# EasyEDA Pro project 激光主轴转接板V1.0.eprj

# Schematic 原理图
Board Name: 电控箱转接; Create Date: 2024-04-22; Page Name: 主控MCU; Project Name: 转接板03; Schematic Name: 原理图; Update Date: 2025-07-30; Company: 嘉立创EDA; Page Size: A3; Version: V1.0
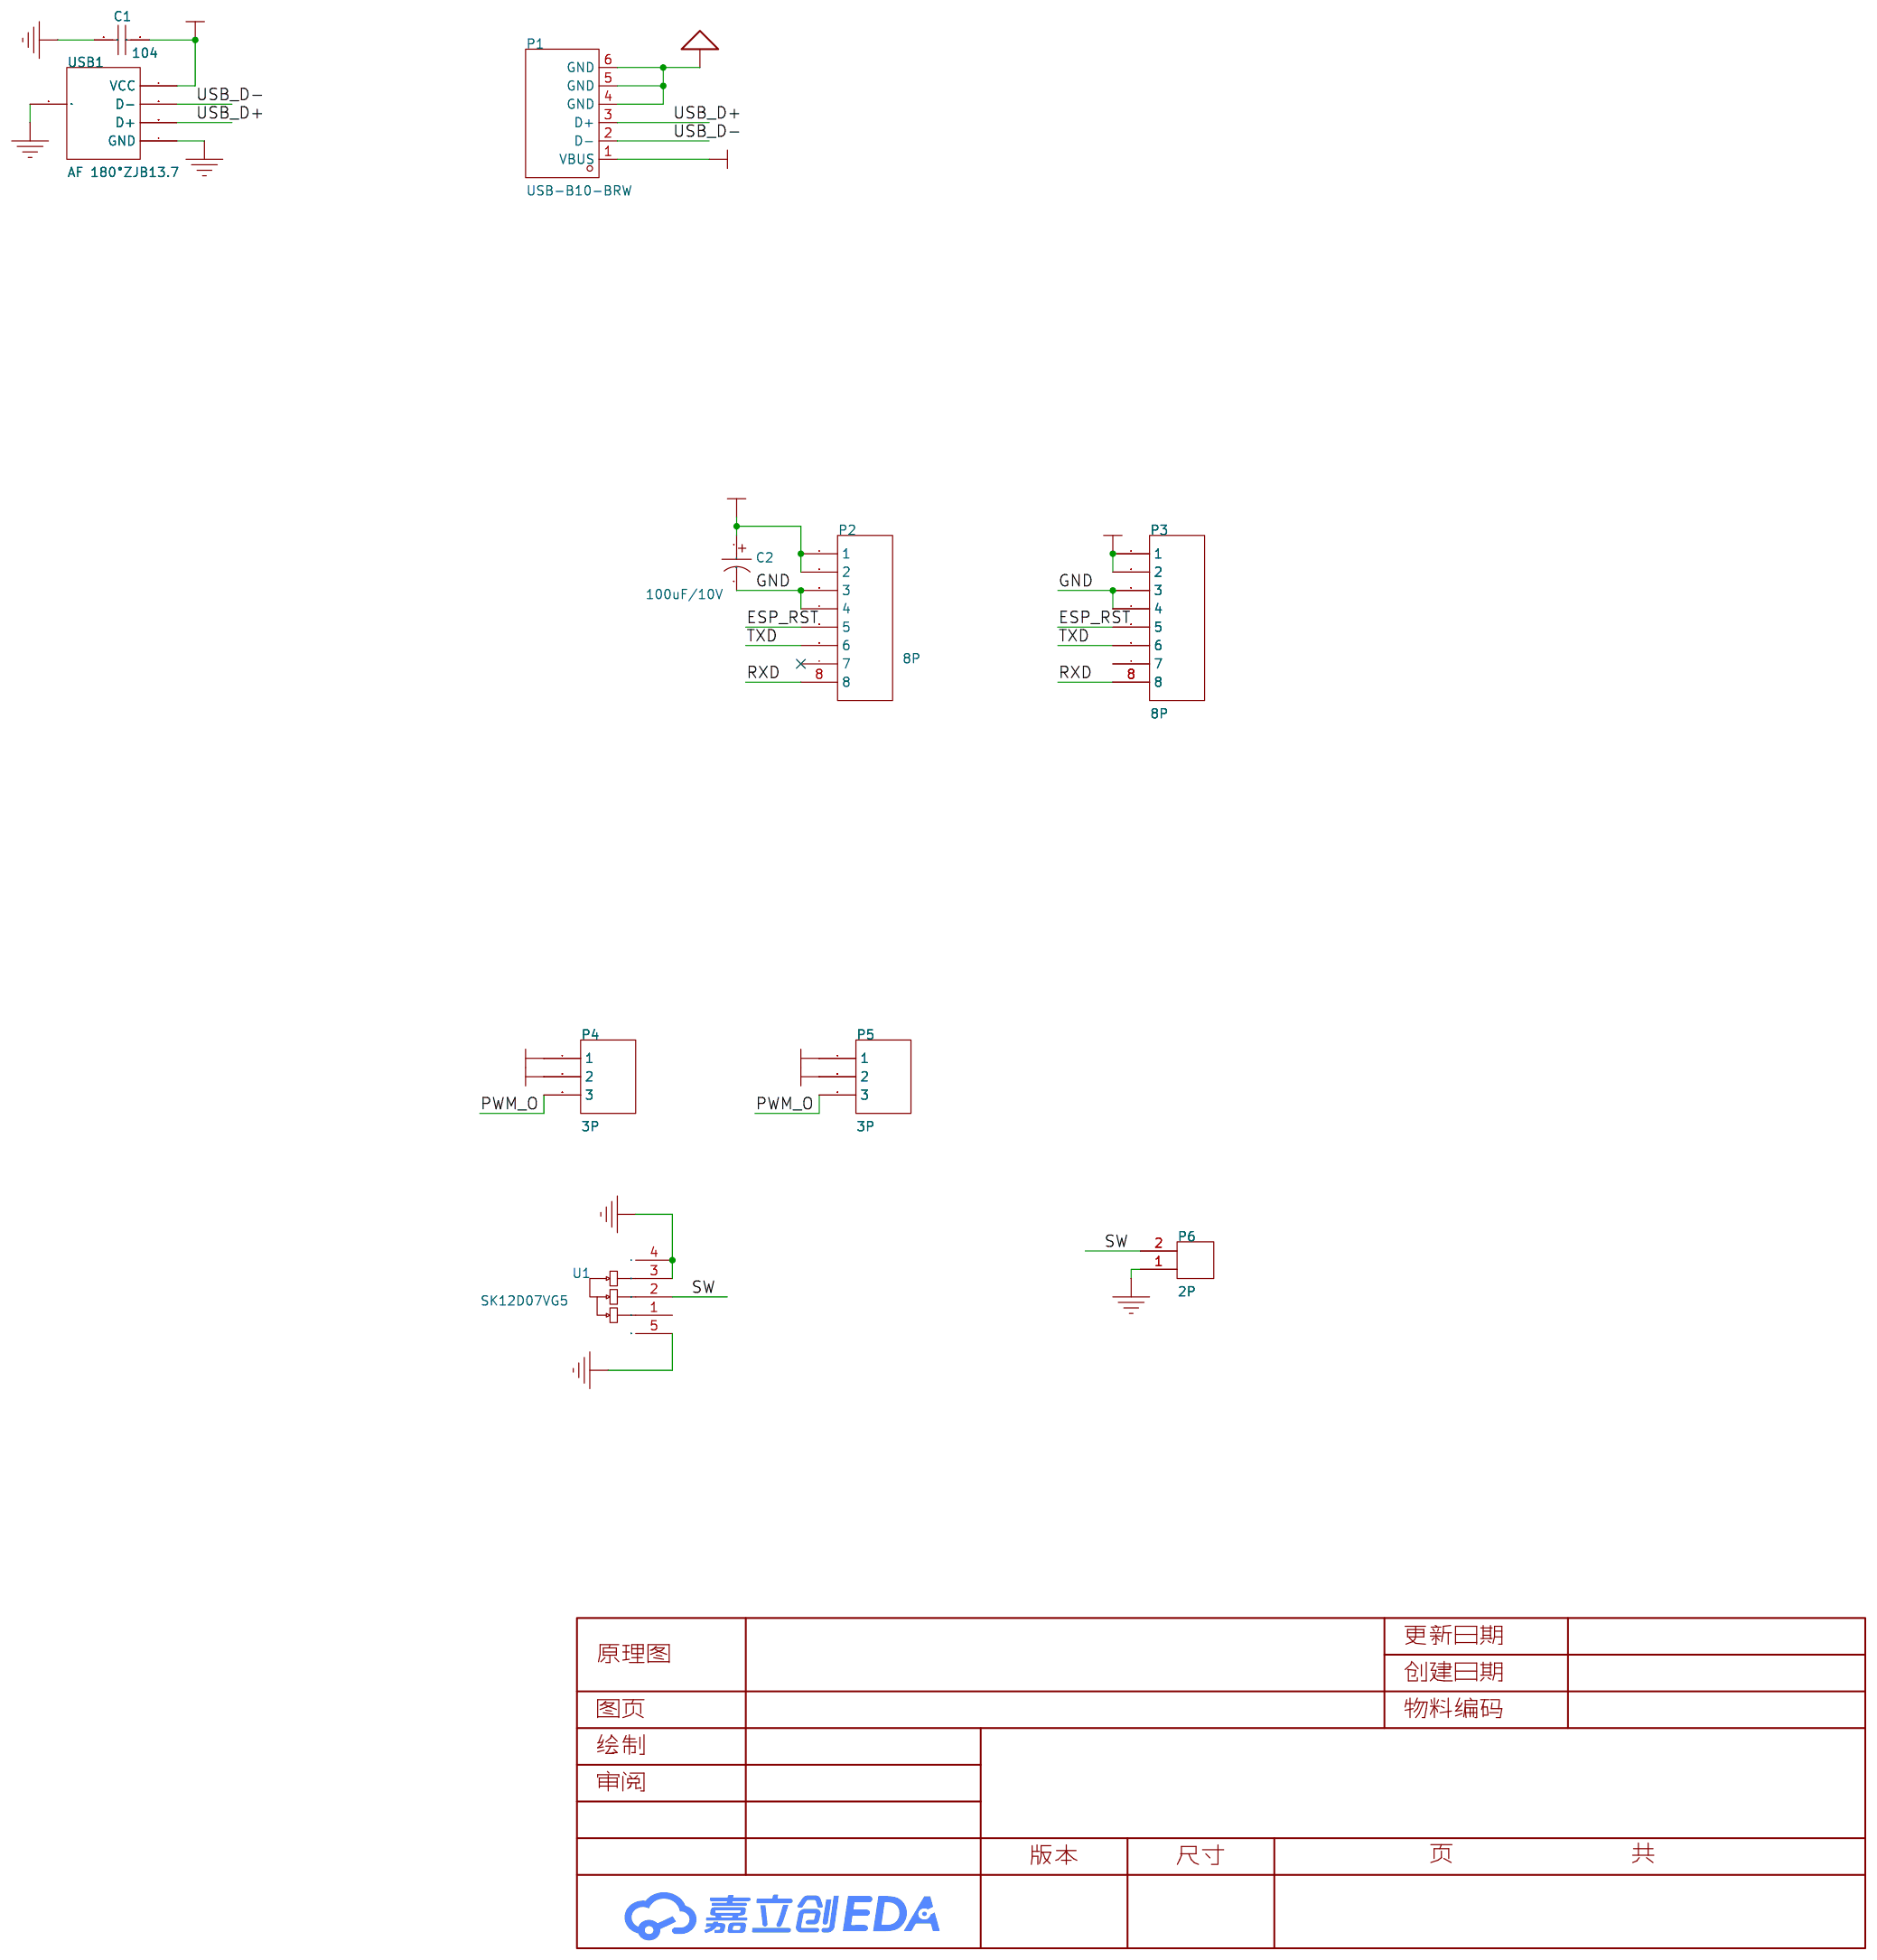
[diagram p0: schematic sheet]

## Parts
C1  104  [0603C]
C2  100uF/10V  [CAP-SMD_BD5.0-L5.3-W5.3-RD]
P1  USB-B10-BRW  [USB-B-TH_USB-B10-BRW]
P2  8P  [IDC8]
P3  8P  [IDC8弯脚]
P4  3P  [HDR1X3_CON]
P5  3P  [HDR1X3_P]
P6  2P  [HDR1X2_CON]
U1  SK12D07VG5  [SW-TH_SHOU_SK12D07VG5]
USB1  AF 180°ZJB13.7  [USB-A-TH_AF-ZJB13.7]

## Library data of the parts
C1 = 104: Capacitor (Semiconductor SIM Model); Published: 8-Jun-2000; LatestRevisionDate: 17-Jul-2002; LatestRevisionNote: Re-released for DXP Platform.; PackageReference: C1206; Publisher: Altium Limited; Origin Footprint 2: C1206; Origin Footprint 3: 0402; Origin Footprint 4: 1310[0504]; Origin Footprint 5: 1608[0603]; Origin Footprint 6: C1210; Origin Footprint 7: C0805; Origin Footprint 8: C1206; Origin Footprint 9: 0805; Origin Footprint 10: 0805L; Design Item ID: Cap Semi; Library Name: Miscellaneous Devices
C2 = CS1A101M-CRD54: 容值:100uF;精度:±20%;额定电压:10V;电容体直径:5mm;电容体长度:5.4mm;纹波电流:-;等效串联电阻:-;工作寿命:1000hrs@105℃;工作温度:-40℃~+105℃;; LCSC Part Name: 100uF ±20% 10V; Supplier Part: C96182; Manufacturer: ST(先科); Supplier Footprint: SMD,5x5.4mm; JLCPCB Part Class: Extended Part; Datasheet: https://atta.szlcsc.com/upload/public/pdf/source/20170304/1488621207726.pdf; Supplier: LCSC; Tolerance: ±20%; Rated Voltage: 10V; φD: 5mm; L: 5.4mm; Lifetime @ Temp: 1000hrs@105℃; Operating Temperature: -40℃~+105℃
P1 = USB-B10-BRW: 连接器类型:Type-B;标准:USB 2.0;公母:母;端口数量:1;触点数量:4P;安装方式:弯插;额定电流 - 电源:1.5A;工作温度范围:-20℃~+70℃;焊接温度(最大值):260℃;; LCSC Part Name: Type-B母弯插; Supplier Part: C720549; Manufacturer: XUNPU(讯普); Supplier Footprint: 插件; JLCPCB Part Class: 扩展库; Datasheet: https://atta.szlcsc.com/upload/public/pdf/source/20200812/C720549_53E9294752E2933874870440E626C579.pdf; Supplier: LCSC; Connector Type: Type-B; Standard: USB2.0; Gender: 母; Number of Ports: 1; Number of Contacts: 4P; Mounting Style: 弯插; Current Rating - Power (Max): 1.5A; Operating Temperature Range: -20℃~+70℃; Soldering Temperature(Max): 260℃
P2 P3 = 8P: Library Name: SCH封装库
P4 P5 = 3P: Library Name: SCH封装库
P6 = 2P: Library Name: SCH--װ--
U1 = SK12D07VG5_C3020419: Supplier Part: C3020419; Manufacturer: SHOU HAN(首韩); Supplier Footprint: 插件; JLCPCB Part Class: 扩展库; Datasheet: https://atta.szlcsc.com/upload/public/pdf/source/20190925/C431548_D6571AEBDE139FDB1E6F8A4B1513A630.pdf; Supplier: LCSC; Circuit: 单刀双掷; Termination Style: PC引脚; Length: 8.7mm; Width: 4.4mm; Switch Height: 4.7mm; Current Rating: 500mA; Voltage Rating: 50V; Life: 5千次; Operating Temperature: -10℃~+50℃
USB1 = AF 180°ZJB13.7: LCSC Part Name: Type-A 母 直插; Supplier Part: C456015; Manufacturer: SHOU HAN(首韩); Supplier Footprint: 插件; JLCPCB Part Class: 扩展库; Datasheet: https://atta.szlcsc.com/upload/public/pdf/source/20241125/3F1287FBF237B0DC4F79F9BB9BA7EB30.pdf; Supplier: LCSC; Connector Type: Type-A; Standard: USB 2.0; Gender: 母; Mounting Style: 直插; Number of Contacts: 4P; Number of Ports: 1; Current Rating - Power (Max): 1.5A; Rated Voltage (Max): 30V; Connect-Disconnect Life: 5千次; Length: 13.7mm; Core Colour: 白色; Operating Temperature Range: -25℃~+85℃

## Nets
5V_VCC: C2.1 P2.1 P2.2 P3.1 P3.2
24V: P4.1 P5.1
GND: C1.2 C2.2 P1.4(GND) P1.5(GND) P1.6(GND) P2.3 P2.4 P3.3 P3.4 P4.2 P5.2 P6.1 U1.3 U1.4 U1.5 USB1.4(GND) USB1.5(SHLD)
ESP_RST: P2.5 P3.5
PWM_O: P4.3 P5.3
RXD: P2.8 P3.8
SW: P6.2 U1.2
TXD: P2.6 P3.6
USB_D+: P1.3(D+) USB1.3(D+)
USB_D-: P1.2(D-) USB1.2(D-)
VUSB: C1.1 P1.1(VBUS) USB1.1(VCC)

Not connected (* = marked no-connect by the designer): P2 7*; P3 7; U1 1

# Board PCB
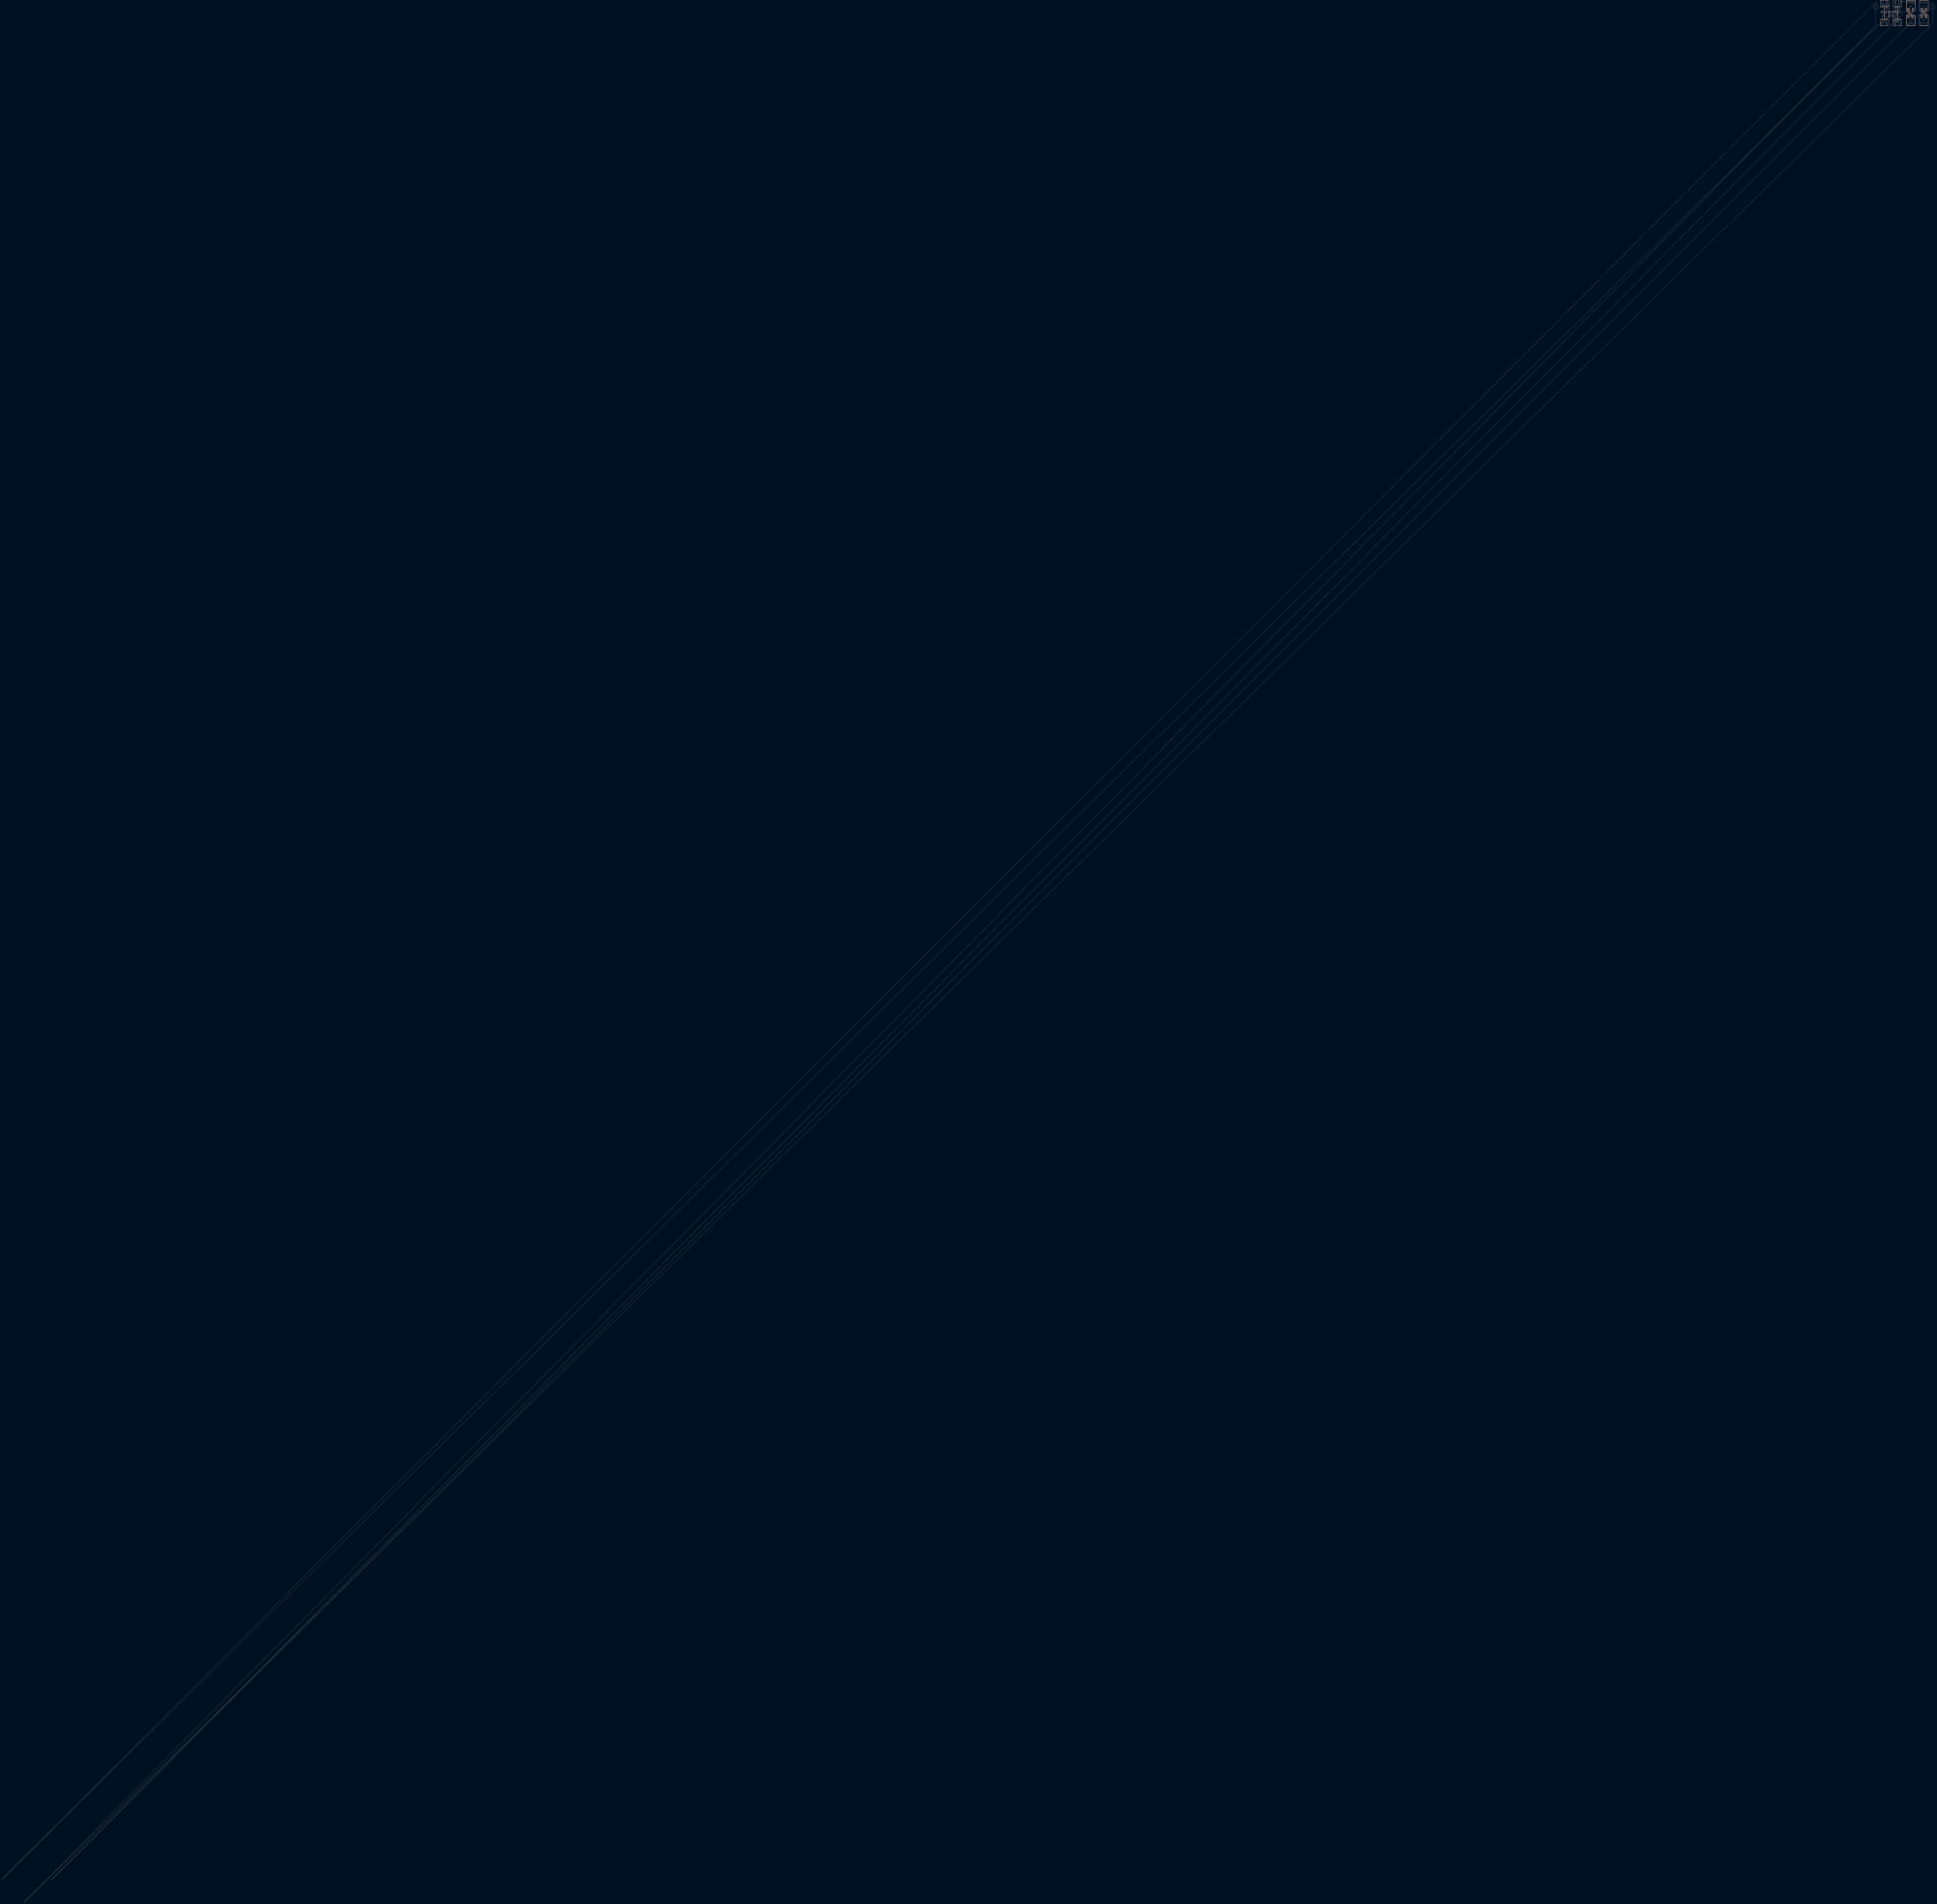
[diagram p1: board, top side]
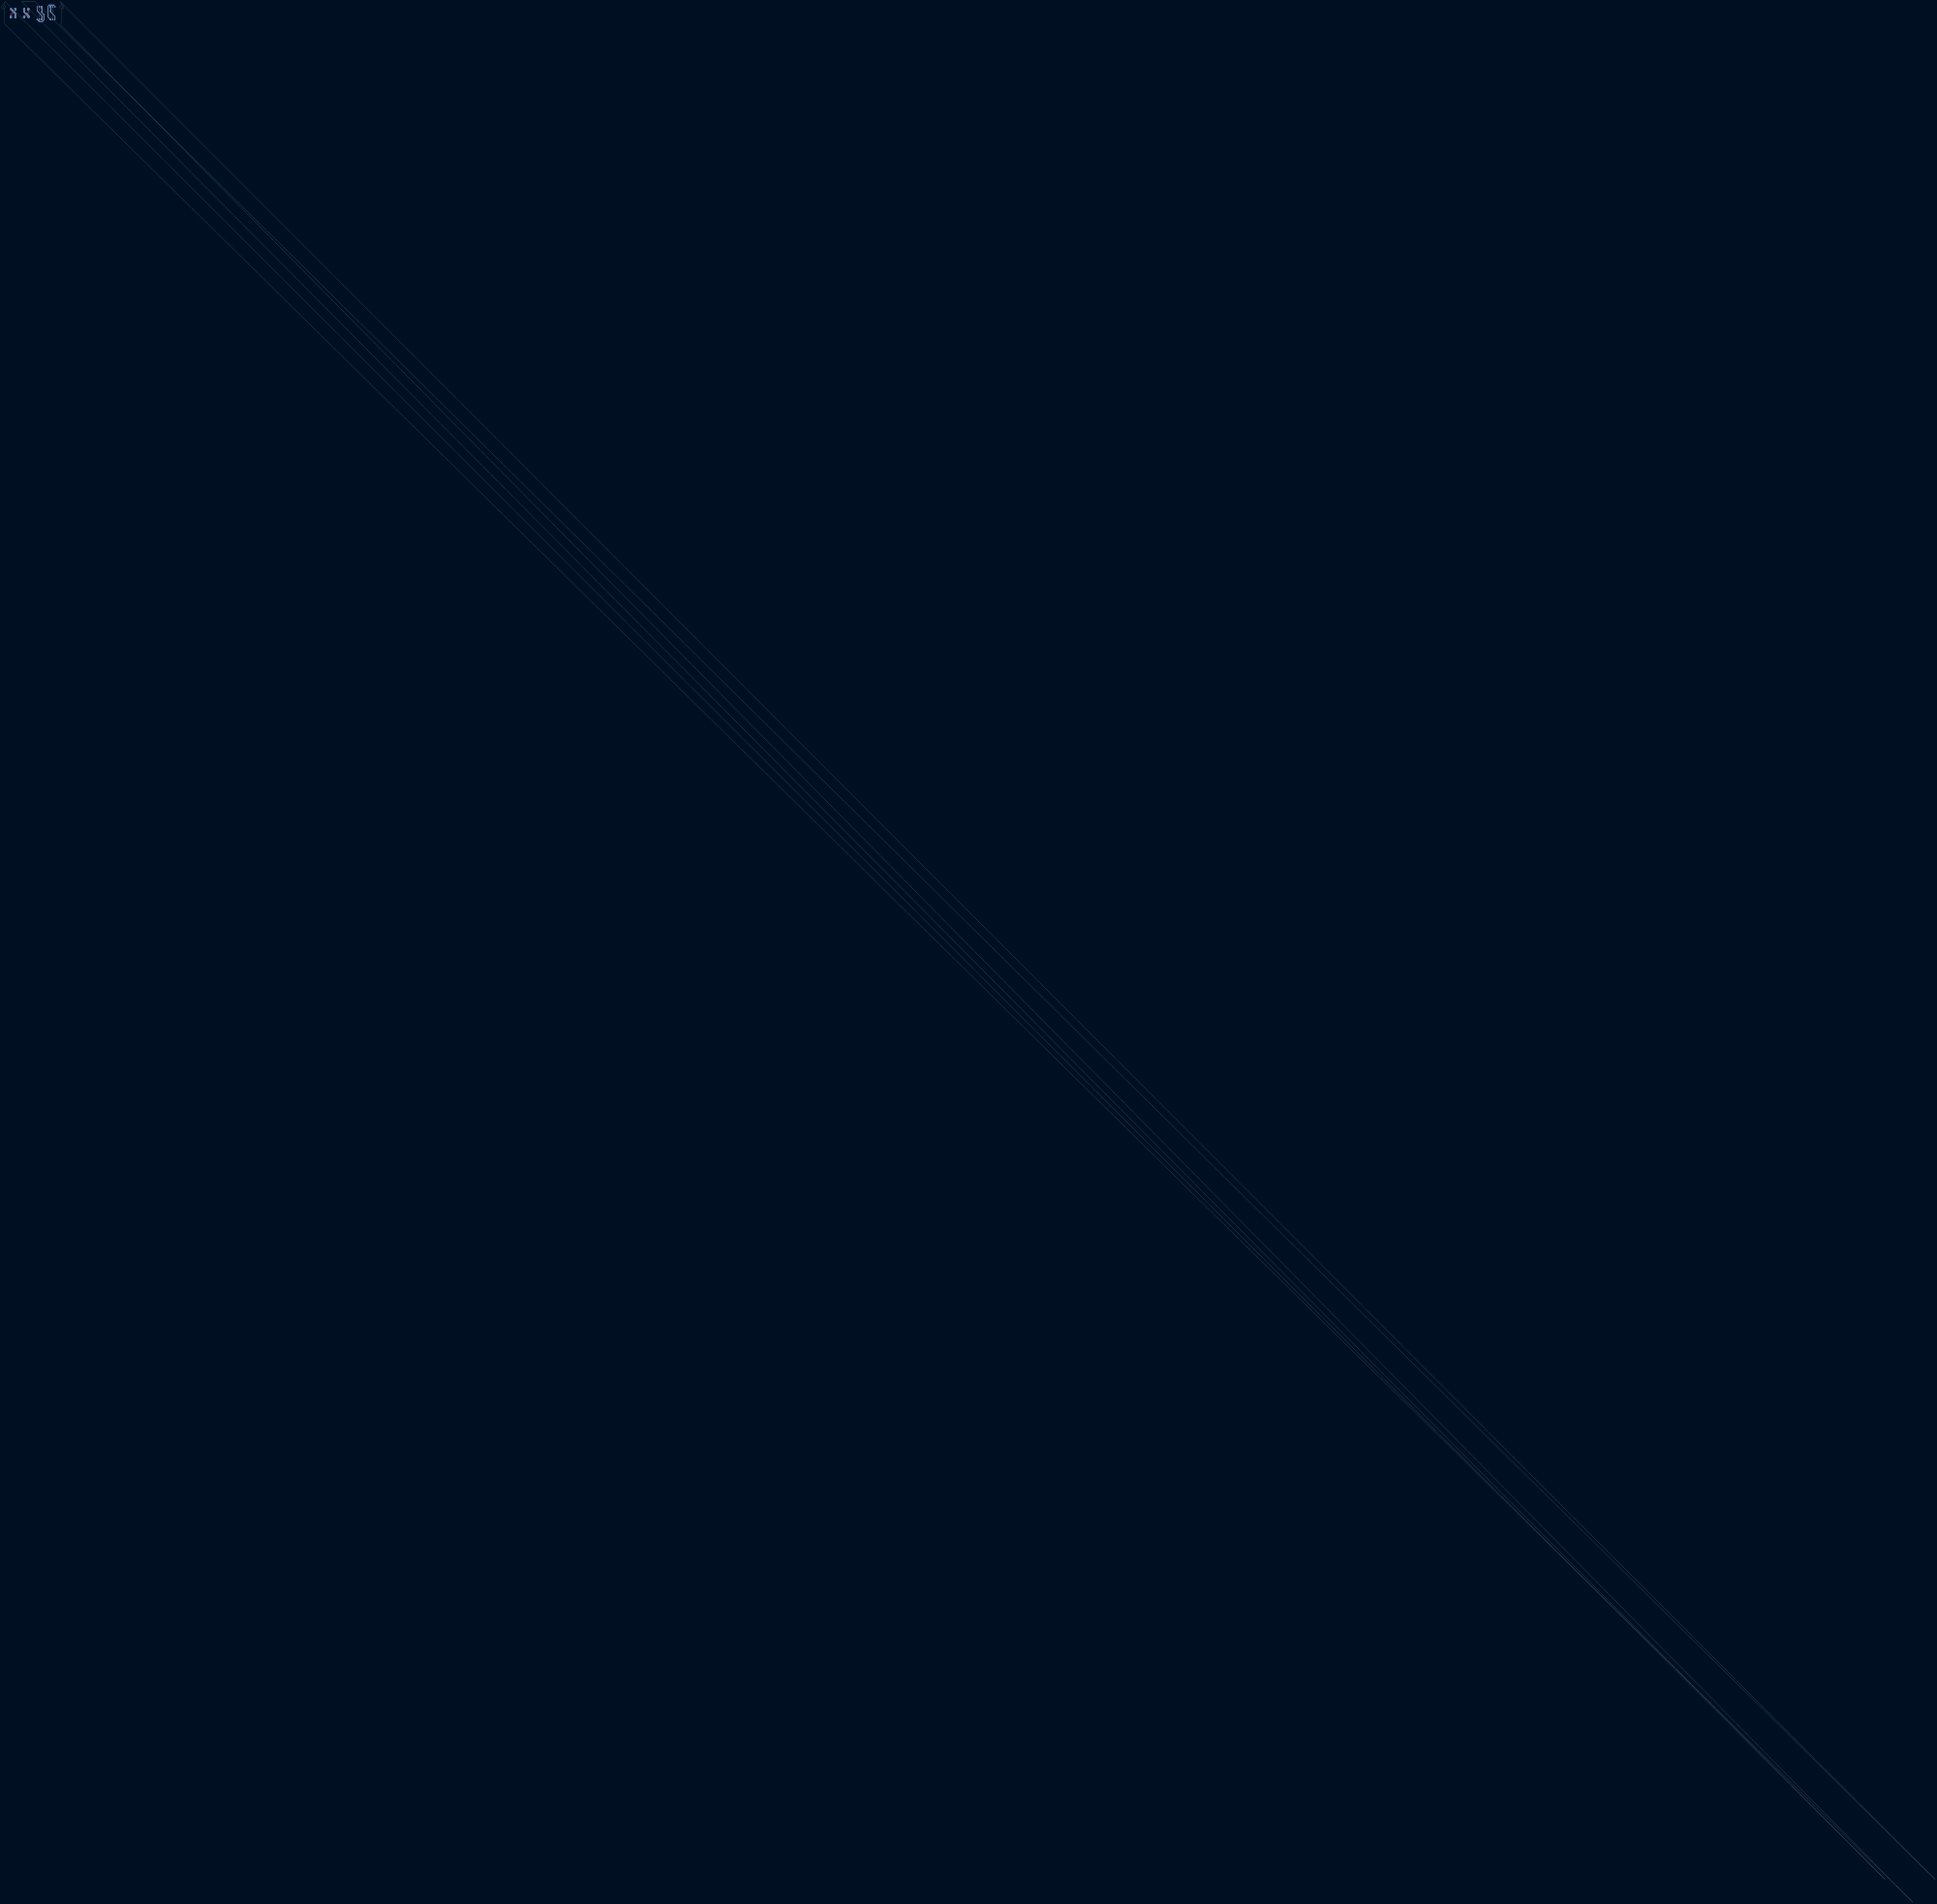
[diagram p2: board, bottom side, seen from below]

Outline 2210.64 x 2173.48 mm; copper layers: Top Layer, Bottom Layer. Coordinates in mm from the lower left corner of the outline.
Outline path: circle c2142.64,2167.48 r1.6 ; circle c2207.64,2167.48 r1.6 ; 25.74,0 2206.64,2147.48 2207.64,2148.48 2207.64,2164.48 arc(2210.64,2167.48) 2207.64,2170.48 2207.64,2172.48 2206.64,2173.48 57.24,26 2187.64,2173.48 2172.48,2173.48 0,26 2143.64,2173.48 2142.64,2172.48 2142.64,2170.48 arc(2139.64,2167.48) 2142.64,2164.48 2142.64,2148.48 2143.64,2147.48 25.74,0
Stack: Top Layer 0.035mm / Dielectric1 1.51mm FR4 er 4.5 / Bottom Layer 0.035mm

## Design rules (mm)
template: 用户自定义配置
spacing Default (default): track to track 0.152, other pairs 0 to 0.152
track width Default (default): min 0.254, default 0.254, max 25.4
differential pair differentialPair (default): width min 0.127, default 0.254, max 2.54; gap min 0.152, default 0.152
via Default (default): diameter min 0.25, default 0.61, max 100.025; hole min 0.2, default 0.305, max 59.995

## Placement (name value [footprint] x y rotation side)
P1  USB-B10-BRW  [HDR1X3_P]  2152.48 2167.73 180 top
P2  8P  [HDR1X3_P]  2152.48 2153.23 0 top
P3  8P  [HDR1X3_P]  2167.48 2167.73 180 top
P4  3P  [HDR1X3_P]  2167.48 2153.23 0 top
P5  3P  [CONN-TH_2P-P5.00_DB2ER-5.0-2P-GN]  2182.51 2172.98 0 top
P6  2P  [CONN-TH_2P-P5.00_DB2ER-5.0-2P-GN]  2182.51 2147.95 180 top
P7  DB2ER-5.0-2P-GN  [CONN-TH_2P-P5.00_DB2ER-5.0-2P-GN]  2197.67 2172.98 0 top
P8  DB2ER-5.0-2P-GN  [CONN-TH_2P-P5.00_DB2ER-5.0-2P-GN]  2197.67 2147.95 180 top

## Footprints (pads in the part's own frame, mm; a bottom-side part is the same pattern mirrored in y, then rotated)
CONN-TH_2P-P5.00_DB2ER-5.0-2P-GN
  rect 2.5x2.5 hole 1.7: 1(-2.5,-8)
  round 2.5 hole 1.7: 2(2.5,-8)
HDR1X3_P
  rect 1.5x1.5 hole 0.86: 1(2.54,0)
  round 1.5 hole 0.86: 2(0,0) 3(-2.54,0)

## Nets
24V: P1.1 P2.1
GND: P1.2 P2.2
V1: P3.1 P4.1
V2: P5.1 P6.1
V3: P7.1 P8.1
G1: P3.2 P4.2
G2: P5.2 P6.2
G3: P7.2 P8.2
PWM_O: P1.3 P2.3
S1: P3.3 P4.3

## Routing (per net, layer and track width the routed paths; a pad name or vN(x,y) marks a point on that pad's centre or on a via; arc(x,y) is an arc through that point)
24V: length 25.8
  Bottom Layer w1: P1.1 2149.94,2168.43 2151.23,2169.71 2156.42,2169.71 2157.69,2168.44 2157.69,2155.9 P2.1
GND: length 14.5
  Top Layer w1: P1.2 P2.2
V1: length 25.5
  Bottom Layer w1: P4.1 2167.55,2150.76 2164.2,2150.76 2162.51,2152.45 2162.51,2158.84 2164.94,2161.27 P3.1
V2: length 11.1
  Top Layer w2: P6.1 2180.01,2160.95 P5.1
V3: length 11.1
  Top Layer w2: P8.1 2200.17,2158.77 2195.17,2163.77 P7.1
G1: length 14.5
  Top Layer w1: P3.2 P4.2
G2: length 11.1
  Bottom Layer w2: P6.2 2180.01,2156.92 2185.01,2161.93 P5.2
G3: length 11.1
  Bottom Layer w2: P7.2 2195.17,2159.98 P8.2
PWM_O: length 16.6
  Bottom Layer w1: P1.3 2155.02,2162.18 2149.94,2157.1 P2.3
S1: length 16.6
  Bottom Layer w1: P4.3 2164.94,2157.76 2170.02,2162.84 P3.3

Small or netless copper shapes (teardrops, artwork), in the pictures only: 8 on Top Layer, 12 on Bottom Layer

## Text on the board
Top Silkscreen Layer: 2025-10-10 | 4040Lite | 激光主轴转接板V1.0
